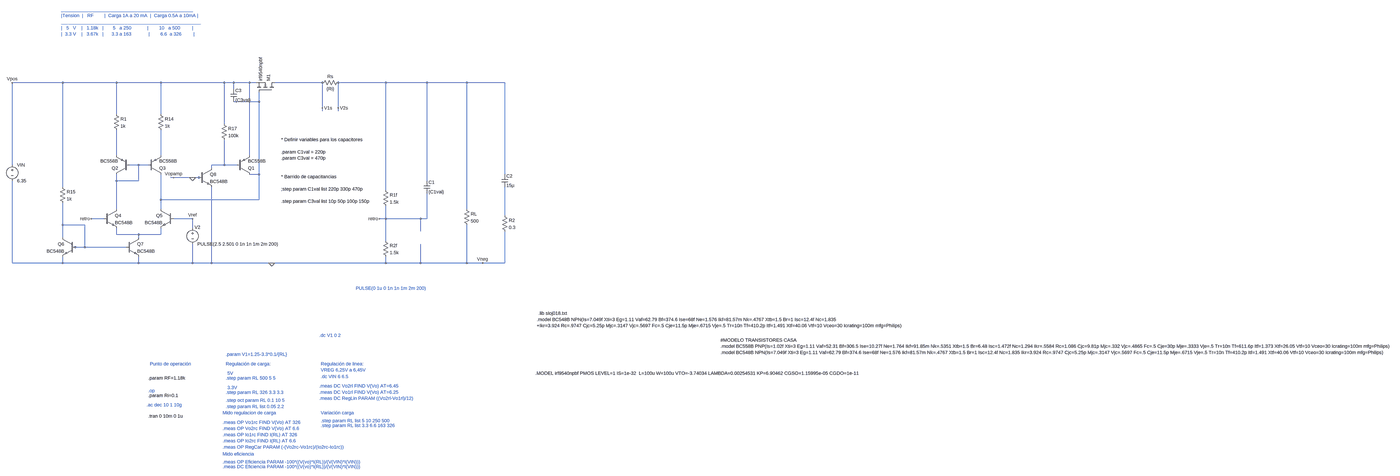
[diagram p0: schematic 2024-09-23 LDO A - rta escalon_relacion de compromiso tpo respuesta estab.asc, whole sheet]
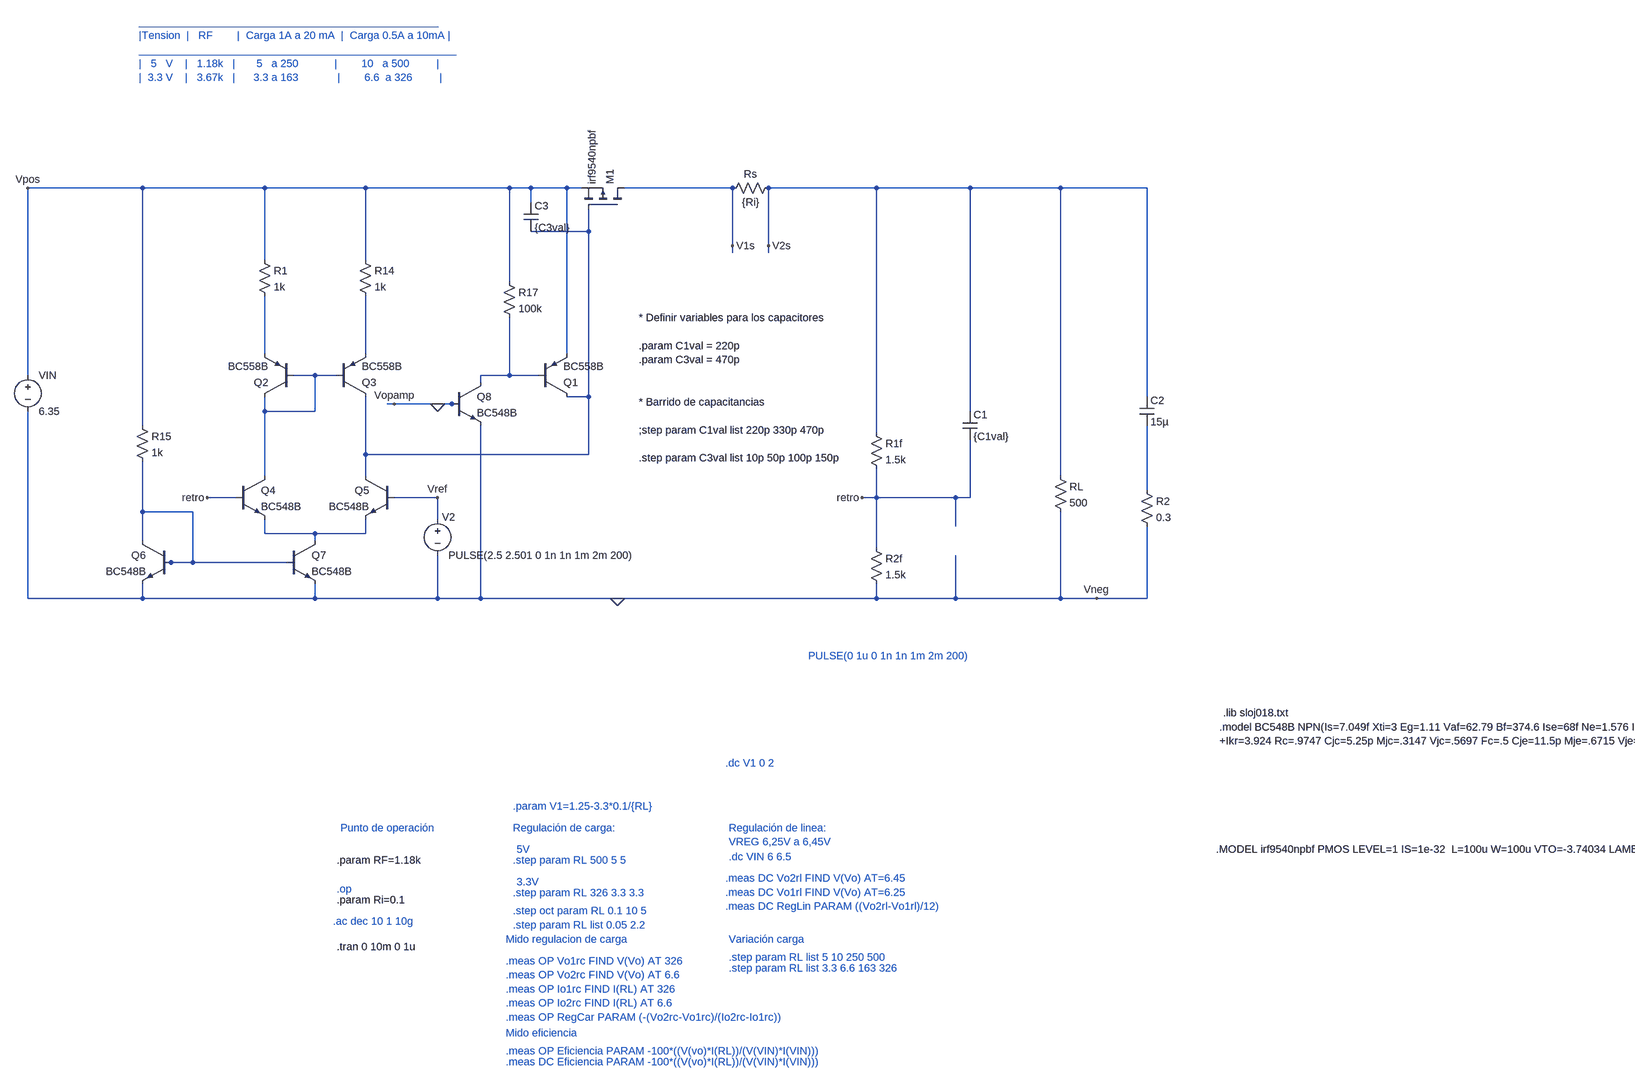
[diagram p1: schematic 2024-09-23 LDO A - rta escalon_relacion de compromiso tpo respuesta estab.asc, part, row 1 of 1, column 1 of 2]
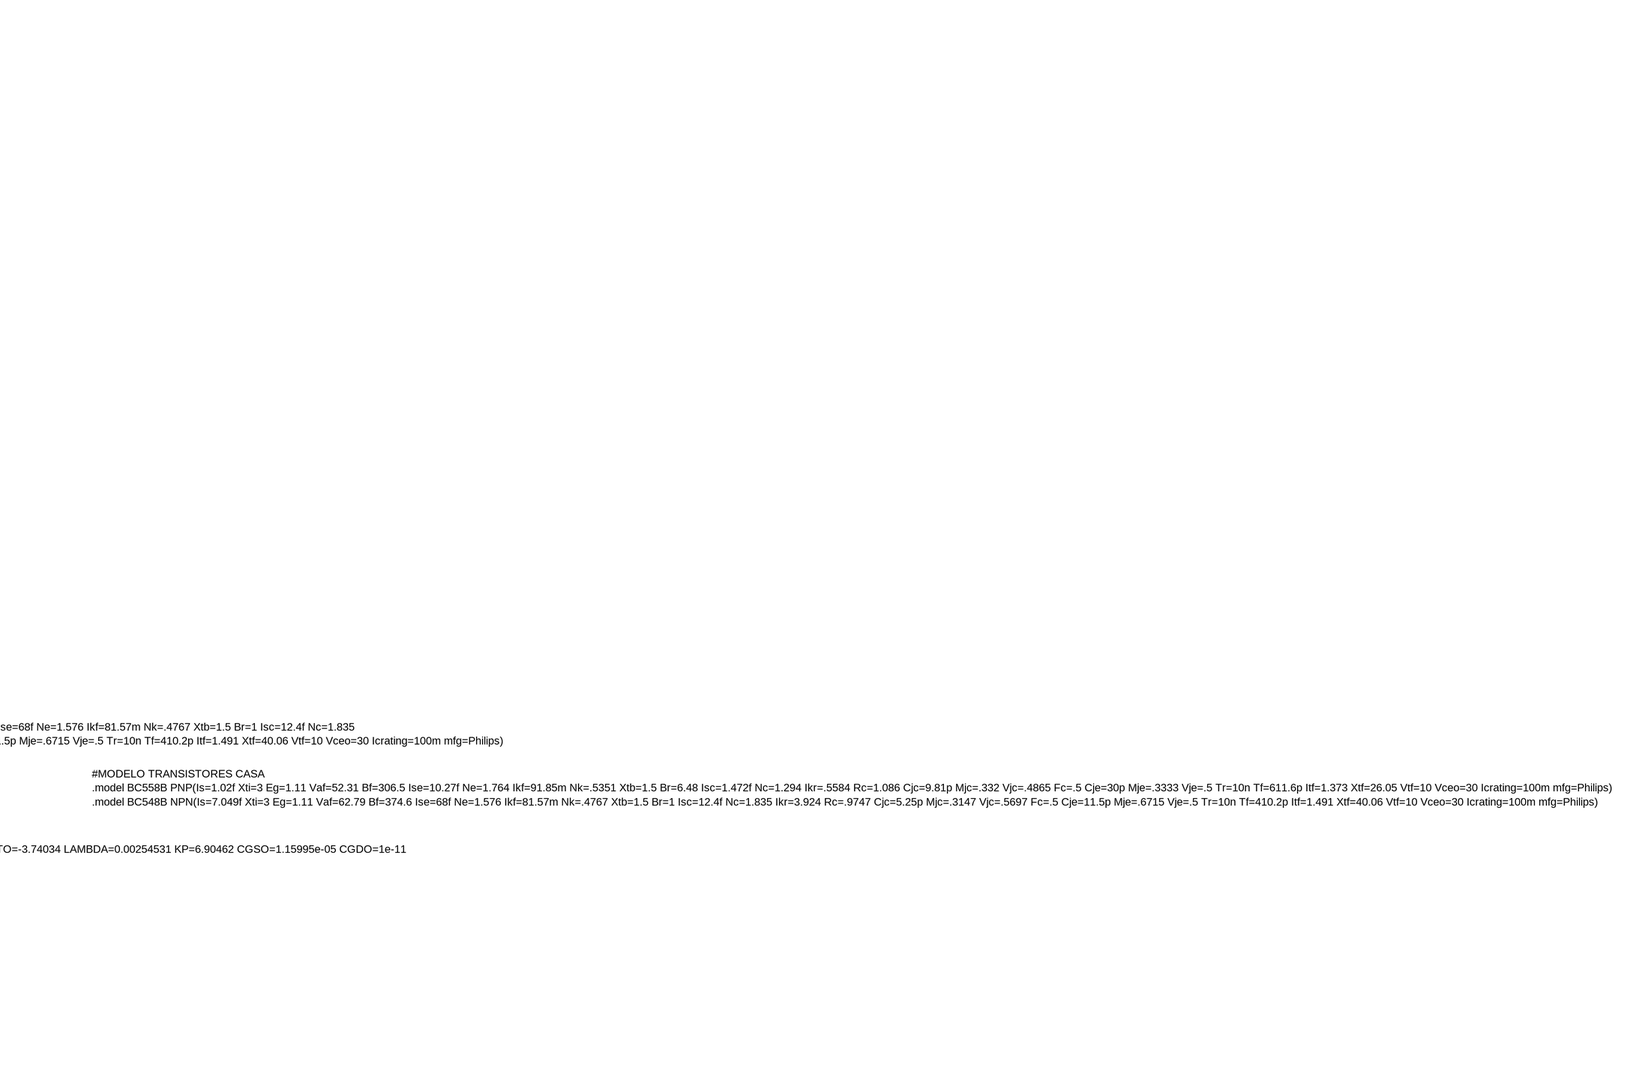
[diagram p2: schematic 2024-09-23 LDO A - rta escalon_relacion de compromiso tpo respuesta estab.asc, part, row 1 of 1, column 2 of 2]
2024-09-23 LDO A - rta escalon_relacion de compromiso tpo respuesta estab.asc, the LTspice schematic file:
Version 4
SHEET 1 6696 2000
WIRE -496 -32 -784 -32
WIRE -224 -32 -496 -32
WIRE 0 -32 -224 -32
WIRE 320 -32 0 -32
WIRE 368 -32 320 -32
WIRE 448 -32 368 -32
WIRE 480 -32 448 -32
WIRE 816 -32 576 -32
WIRE 1136 -32 896 -32
WIRE 1344 -32 1136 -32
WIRE 1552 -32 1344 -32
WIRE 1744 -32 1552 -32
WIRE 368 0 368 -32
WIRE 496 64 496 16
WIRE 496 64 368 64
WIRE 816 96 816 -32
WIRE 896 96 896 -32
WIRE 816 112 816 96
WIRE 896 112 896 96
WIRE -224 128 -224 -32
WIRE 0 128 0 -32
WIRE 320 176 320 -32
WIRE -224 336 -224 208
WIRE 0 336 0 208
WIRE 448 336 448 -32
WIRE -784 384 -784 -32
WIRE -112 384 -160 384
WIRE -64 384 -112 384
WIRE 320 384 320 256
WIRE 320 384 256 384
WIRE 384 384 320 384
WIRE 256 400 256 384
WIRE 496 432 496 64
WIRE 496 432 448 432
WIRE 1744 432 1744 -32
WIRE 64 448 48 448
WIRE 160 448 64 448
WIRE 192 448 160 448
WIRE 208 448 192 448
WIRE -224 464 -224 432
WIRE -112 464 -112 384
WIRE -112 464 -224 464
WIRE 1344 464 1344 -32
WIRE -496 496 -496 -32
WIRE 1136 512 1136 -32
WIRE 0 560 0 432
WIRE 496 560 496 432
WIRE 496 560 0 560
WIRE -224 608 -224 464
WIRE 0 608 0 560
WIRE 1552 608 1552 -32
WIRE 1744 640 1744 496
WIRE -288 656 -352 656
WIRE 160 656 64 656
WIRE 1136 656 1136 592
WIRE 1136 656 1104 656
WIRE 1312 656 1136 656
WIRE 1344 656 1344 528
WIRE 1344 656 1312 656
WIRE -496 688 -496 576
WIRE -384 688 -496 688
WIRE 160 704 160 656
WIRE 1312 720 1312 656
WIRE -224 736 -224 704
WIRE -112 736 -224 736
WIRE 0 736 0 704
WIRE 0 736 -112 736
WIRE -496 752 -496 688
WIRE -112 752 -112 736
WIRE 1136 768 1136 656
WIRE -432 800 -448 800
WIRE -384 800 -384 688
WIRE -384 800 -432 800
WIRE -176 800 -384 800
WIRE -784 880 -784 464
WIRE -496 880 -496 848
WIRE -496 880 -784 880
WIRE -112 880 -112 848
WIRE -112 880 -496 880
WIRE 160 880 160 784
WIRE 160 880 -112 880
WIRE 256 880 256 496
WIRE 256 880 160 880
WIRE 560 880 256 880
WIRE 1136 880 1136 848
WIRE 1136 880 560 880
WIRE 1312 880 1312 784
WIRE 1312 880 1136 880
WIRE 1552 880 1552 688
WIRE 1552 880 1312 880
WIRE 1632 880 1552 880
WIRE 1744 880 1744 720
WIRE 1744 880 1632 880
FLAG 560 880 0
FLAG -784 -32 Vpos
FLAG 816 96 V1s
FLAG 896 96 V2s
FLAG 1632 880 Vneg
FLAG 160 656 Vref
FLAG -352 656 retro
FLAG 64 448 Vopamp
FLAG 160 448 0
FLAG 1104 656 retro
DATAFLAG 1040 -32 ""
DATAFLAG 96 -32 ""
SYMBOL res 1536 592 R0
SYMATTR InstName RL
SYMATTR Value 500
SYMBOL voltage -784 368 R0
WINDOW 123 24 124 Left 2
WINDOW 39 0 0 Left 0
SYMATTR InstName VIN
SYMATTR Value 6.35
SYMBOL res 1120 496 R0
SYMATTR InstName R1f
SYMATTR Value 1.5k
SYMBOL res 1120 752 R0
SYMATTR InstName R2f
SYMATTR Value 1.5k
SYMBOL res 912 -48 R90
WINDOW 0 0 56 VBottom 2
WINDOW 3 32 56 VTop 2
SYMATTR InstName Rs
SYMATTR Value {Ri}
SYMBOL pnp -160 432 R180
SYMATTR InstName Q2
SYMATTR Value BC558B
SYMBOL pnp -64 432 M180
SYMATTR InstName Q3
SYMATTR Value BC558B
SYMBOL npn -288 608 R0
SYMATTR InstName Q4
SYMATTR Value BC548B
SYMBOL npn 64 608 M0
SYMATTR InstName Q5
SYMATTR Value BC548B
SYMBOL res -240 112 R0
SYMATTR InstName R1
SYMATTR Value 1k
SYMBOL res -16 112 R0
SYMATTR InstName R14
SYMATTR Value 1k
SYMBOL res -512 480 R0
SYMATTR InstName R15
SYMATTR Value 1k
SYMBOL npn -432 752 M0
SYMATTR InstName Q6
SYMATTR Value BC548B
SYMBOL npn -176 752 R0
SYMATTR InstName Q7
SYMATTR Value BC548B
SYMBOL pmos 576 16 M270
SYMATTR InstName M1
SYMATTR Value irf9540npbf
SYMBOL voltage 160 688 R0
WINDOW 0 10 11 Left 2
WINDOW 39 0 0 Left 0
SYMATTR InstName V2
SYMATTR Value PULSE(2.5 2.501 0 1n 1n 1m 2m 200)
SYMATTR Value2 AC 1
SYMBOL pnp 384 432 M180
SYMATTR InstName Q1
SYMATTR Value BC558B
SYMBOL npn 192 400 R0
SYMATTR InstName Q8
SYMATTR Value BC548B
SYMBOL res 304 160 R0
SYMATTR InstName R17
SYMATTR Value 100k
SYMBOL Cap 1728 432 R0
SYMATTR InstName C2
SYMATTR Value 15µ
SYMBOL Cap 352 0 R0
SYMATTR InstName C3
SYMATTR Value {C3val}
SYMBOL Res 1728 624 R0
SYMATTR InstName R2
SYMATTR Value 0.3
SYMBOL cap 1328 464 R0
SYMATTR InstName C1
SYMATTR Value {C1val}
TEXT -64 1536 Left 2 ;.op
TEXT 808 1464 Left 2 ;.dc VIN 6 6.5
TEXT 328 1472 Left 2 ;.step param RL 500 5 5
TEXT 1984 1448 Left 2 !.MODEL irf9540npbf PMOS LEVEL=1 IS=1e-32  L=100u W=100u VTO=-3.74034 LAMBDA=0.00254531 KP=6.90462 CGSO=1.15995e-05 CGDO=1e-11
TEXT 328 1400 Left 2 ;Regulación de carga:
TEXT 808 1400 Left 2 ;Regulación de linea:\nVREG 6,25V a 6,45V
TEXT 808 1688 Left 2 ;.step param RL list 5 10 250 500
TEXT -64 1472 Left 2 !.param RF=1.18k
TEXT -56 1400 Left 2 ;Punto de operación
TEXT 800 1512 Left 2 ;.meas DC Vo2rl FIND V(Vo) AT=6.45\n.meas DC Vo1rl FIND V(Vo) AT=6.25\n.meas DC RegLin PARAM ((Vo2rl-Vo1rl)/12)
TEXT 336 1448 Left 2 ;5V
TEXT 336 1520 Left 2 ;3.3V
TEXT 328 1544 Left 2 ;.step param RL 326 3.3 3.3
TEXT 312 1696 Left 2 ;.meas OP Vo1rc FIND V(Vo) AT 326\n.meas OP Vo2rc FIND V(Vo) AT 6.6\n.meas OP Io1rc FIND I(RL) AT 326\n.meas OP Io2rc FIND I(RL) AT 6.6\n.meas OP RegCar PARAM (-(Vo2rc-Vo1rc)/(Io2rc-Io1rc))
TEXT 312 1856 Left 2 ;Mido eficiencia
TEXT 312 1896 Left 2 ;.meas OP Eficiencia PARAM -100*((V(vo)*I(RL))/(V(VIN)*I(VIN)))
TEXT 312 1648 Left 2 ;Mido regulacion de carga
TEXT 808 1648 Left 2 ;Variación carga
TEXT -504 -616 Left 2 ;__________________________________________________\n|Tension  |   RF        |  Carga 1A a 20 mA  |  Carga 0.5A a 10mA |\n_____________________________________________________\n|   5   V    |   1.18k   |       5   a 250            |        10   a 500         |\n|  3.3 V    |   3.67k   |      3.3 a 163             |        6.6  a 326         |
TEXT 808 1712 Left 2 ;.step param RL list 3.3 6.6 163 326
TEXT 312 1920 Left 2 ;.meas DC Eficiencia PARAM -100*((V(vo)*I(RL))/(V(VIN)*I(VIN)))
TEXT -64 1560 Left 2 !.param Ri=0.1
TEXT 328 1584 Left 2 ;.step oct param RL 0.1 10 5
TEXT 1992 1176 Left 2 !.model BC548B NPN(Is=7.049f Xti=3 Eg=1.11 Vaf=62.79 Bf=374.6 Ise=68f Ne=1.576 Ikf=81.57m Nk=.4767 Xtb=1.5 Br=1 Isc=12.4f Nc=1.835\n+Ikr=3.924 Rc=.9747 Cjc=5.25p Mjc=.3147 Vjc=.5697 Fc=.5 Cje=11.5p Mje=.6715 Vje=.5 Tr=10n Tf=410.2p Itf=1.491 Xtf=40.06 Vtf=10 Vceo=30 Icrating=100m mfg=Philips)
TEXT 2000 1144 Left 2 !.lib sloj018.txt
TEXT 2920 1280 Left 2 !#MODELO TRANSISTORES CASA\n.model BC558B PNP(Is=1.02f Xti=3 Eg=1.11 Vaf=52.31 Bf=306.5 Ise=10.27f Ne=1.764 Ikf=91.85m Nk=.5351 Xtb=1.5 Br=6.48 Isc=1.472f Nc=1.294 Ikr=.5584 Rc=1.086 Cjc=9.81p Mjc=.332 Vjc=.4865 Fc=.5 Cje=30p Mje=.3333 Vje=.5 Tr=10n Tf=611.6p Itf=1.373 Xtf=26.05 Vtf=10 Vceo=30 Icrating=100m mfg=Philips)\n.model BC548B NPN(Is=7.049f Xti=3 Eg=1.11 Vaf=62.79 Bf=374.6 Ise=68f Ne=1.576 Ikf=81.57m Nk=.4767 Xtb=1.5 Br=1 Isc=12.4f Nc=1.835 Ikr=3.924 Rc=.9747 Cjc=5.25p Mjc=.3147 Vjc=.5697 Fc=.5 Cje=11.5p Mje=.6715 Vje=.5 Tr=10n Tf=410.2p Itf=1.491 Xtf=40.06 Vtf=10 Vceo=30 Icrating=100m mfg=Philips)
TEXT 800 1256 Left 2 ;.dc V1 0 2
TEXT 328 1352 Left 2 ;.param V1=1.25-3.3*0.1/{RL}
TEXT 328 1616 Left 2 ;.step param RL list 0.05 2.2
TEXT -72 1608 Left 2 ;.ac dec 10 1 10g
TEXT -64 1664 Left 2 !.tran 0 10m 0 1u
TEXT 984 1008 Left 2 ;PULSE(0 1u 0 1n 1n 1m 2m 200)
TEXT 608 256 Left 2 !* Definir variables para los capacitores\n \n.param C1val = 220p\n.param C3val = 470p\n \n \n* Barrido de capacitancias\n \n;step param C1val list 220p 330p 470p\n \n.step param C3val list 10p 50p 100p 150p

The netlist it stands for:
* 2024-09-23 LDO A - rta escalon_relacion de compromiso tpo respuesta estab.asc
RL V2s 0 500
VIN Vpos 0 6.35
R1f V2s retro 1.5k
R2f retro 0 1.5k
Rs V2s V1s {Ri}
Q2 N004 N004 N002 0 BC558B
Q3 N001 N004 N003 0 BC558B
Q4 N004 retro N008 0 BC548B
Q5 N001 Vref N008 0 BC548B
R1 Vpos N002 1k
R14 Vpos N003 1k
R15 Vpos N007 1k
Q6 N007 N007 0 0 BC548B
Q7 N008 N007 0 0 BC548B
M1 V1s N001 Vpos Vpos irf9540npbf
V2 Vref 0 PULSE(2.5 2.501 0 1n 1n 1m 2m 200) AC 1
Q1 N001 N005 Vpos 0 BC558B
Q8 N005 0 0 0 BC548B
R17 Vpos N005 100k
C2 V2s N006 15µ
C3 Vpos N001 {C3val}
R2 N006 0 0.3
C1 V2s retro {C1val}
.model NPN NPN
.model PNP PNP
.lib standard.bjt
.model NMOS NMOS
.model PMOS PMOS
.lib standard.mos
* .op
* .dc VIN 6 6.5
* .step param RL 500 5 5
.MODEL irf9540npbf PMOS LEVEL=1 IS=1e-32  L=100u W=100u VTO=-3.74034 LAMBDA=0.00254531 KP=6.90462 CGSO=1.15995e-05 CGDO=1e-11
* Regulación de carga:
* Regulación de linea:
* VREG 6,25V a 6,45V
* .step param RL list 5 10 250 500
.param RF=1.18k
* Punto de operación
* .meas DC Vo2rl FIND V(Vo) AT=6.45
* .meas DC Vo1rl FIND V(Vo) AT=6.25
* .meas DC RegLin PARAM ((Vo2rl-Vo1rl)/12)
* 5V
* 3.3V
* .step param RL 326 3.3 3.3
* .meas OP Vo1rc FIND V(Vo) AT 326
* .meas OP Vo2rc FIND V(Vo) AT 6.6
* .meas OP Io1rc FIND I(RL) AT 326
* .meas OP Io2rc FIND I(RL) AT 6.6
* .meas OP RegCar PARAM (-(Vo2rc-Vo1rc)/(Io2rc-Io1rc))
* Mido eficiencia
* .meas OP Eficiencia PARAM -100*((V(vo)*I(RL))/(V(VIN)*I(VIN)))
* Mido regulacion de carga
* Variación carga
* __________________________________________________
* |Tension  |   RF        |  Carga 1A a 20 mA  |  Carga 0.5A a 10mA |
* _____________________________________________________
* |   5   V    |   1.18k   |       5   a 250            |        10   a 500         |
* |  3.3 V    |   3.67k   |      3.3 a 163             |        6.6  a 326         |
* .step param RL list 3.3 6.6 163 326
* .meas DC Eficiencia PARAM -100*((V(vo)*I(RL))/(V(VIN)*I(VIN)))
.param Ri=0.1
* .step oct param RL 0.1 10 5
.model BC548B NPN(Is=7.049f Xti=3 Eg=1.11 Vaf=62.79 Bf=374.6 Ise=68f Ne=1.576 Ikf=81.57m Nk=.4767 Xtb=1.5 Br=1 Isc=12.4f Nc=1.835
+Ikr=3.924 Rc=.9747 Cjc=5.25p Mjc=.3147 Vjc=.5697 Fc=.5 Cje=11.5p Mje=.6715 Vje=.5 Tr=10n Tf=410.2p Itf=1.491 Xtf=40.06 Vtf=10 Vceo=30 Icrating=100m mfg=Philips)
.lib sloj018.txt
#MODELO TRANSISTORES CASA
.model BC558B PNP(Is=1.02f Xti=3 Eg=1.11 Vaf=52.31 Bf=306.5 Ise=10.27f Ne=1.764 Ikf=91.85m Nk=.5351 Xtb=1.5 Br=6.48 Isc=1.472f Nc=1.294 Ikr=.5584 Rc=1.086 Cjc=9.81p Mjc=.332 Vjc=.4865 Fc=.5 Cje=30p Mje=.3333 Vje=.5 Tr=10n Tf=611.6p Itf=1.373 Xtf=26.05 Vtf=10 Vceo=30 Icrating=100m mfg=Philips)
.model BC548B NPN(Is=7.049f Xti=3 Eg=1.11 Vaf=62.79 Bf=374.6 Ise=68f Ne=1.576 Ikf=81.57m Nk=.4767 Xtb=1.5 Br=1 Isc=12.4f Nc=1.835 Ikr=3.924 Rc=.9747 Cjc=5.25p Mjc=.3147 Vjc=.5697 Fc=.5 Cje=11.5p Mje=.6715 Vje=.5 Tr=10n Tf=410.2p Itf=1.491 Xtf=40.06 Vtf=10 Vceo=30 Icrating=100m mfg=Philips)
* .dc V1 0 2
* .param V1=1.25-3.3*0.1/{RL}
* .step param RL list 0.05 2.2
* .ac dec 10 1 10g
.tran 0 10m 0 1u
* PULSE(0 1u 0 1n 1n 1m 2m 200)
* Definir variables para los capacitores
.param C1val = 220p
.param C3val = 470p
* Barrido de capacitancias
;step param C1val list 220p 330p 470p
.step param C3val list 10p 50p 100p 150p
.backanno
.end